# Altium schematic sheet Door.SchDoc
size A4
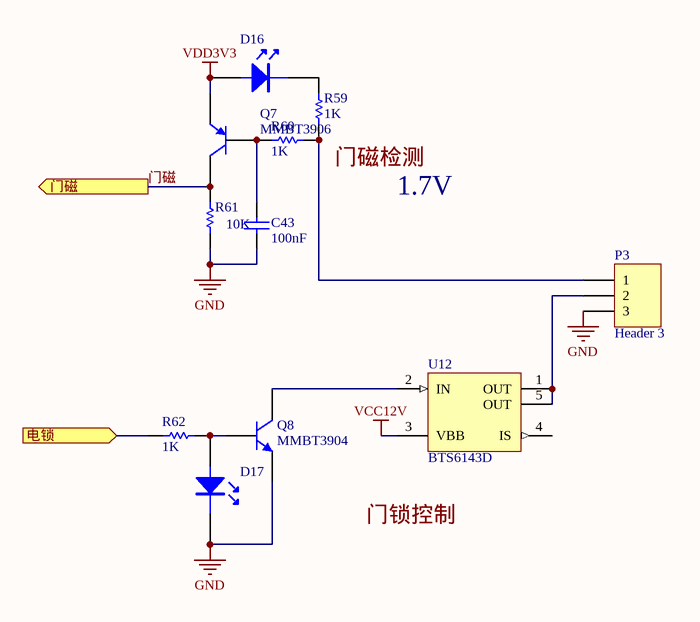
[diagram p0: Door.SchDoc]

## Parts
C43  value 100nF  [CAPC0805(2012)100_L]  (hidden comment: CAP 100nF 50V 0805(2012))
D16  (no value)  [0805-L]
D17  (no value)  [0805-L]
P3  Header 3  [HDR1X3]
Q7  MMBT3906  [SOT23_N]
Q8  MMBT3904  [SOT23_N]
R59  value 1K  [RESC0805(2012)_M]  (hidden comment: 1K 1% 0805(2012))
R60  value 1K  [RESC0805(2012)_M]  (hidden comment: 1K 1% 0805(2012))
R61  value 10K  [RESC0805(2012)_M]  (hidden comment: 10K 1% 0805(2012))
R62  value 1K  [RESC0805(2012)_M]  (hidden comment: 1K 1% 0805(2012))
U12  BTS6143D  [INF-PG-TO252-5-11_M]

## Ports
电锁 (in), 门磁 (out)

## Nets
GND: C43.1 D17.2 P3.3 Q8.2(E) R61.1
VCC12V: U12.3(VBB)
VDD3V3: D16.1 Q7.2(E)
电锁: R62.2 ; port 电锁
门磁: Q7.3(C) R61.2 ; port 门磁
NetC43_2: C43.2 Q7.1(B) R60.1
NetD16_2: D16.2 R59.2
NetD17_1: D17.1 Q8.1(B) R62.1
NetP3_1: P3.1 R59.1 R60.2
NetP3_2: P3.2 U12.1(OUT) U12.5(OUT)
NetQ8_3: Q8.3(C) U12.2(IN)

Not connected (* = marked no-connect by the designer): U12 4(IS)

## Notes on the sheet
- 门磁检测
- 1.7V
- 门锁控制

## Library data of the parts
C43 = CMP-1036-04418-1: CAP 100nF 50V ±5% 0805 (2012 Metric) Thickness 1mm SMD; Case-EIA: 0805; Case-Metric: 2012; Tolerance: ±5%; Max Thickness: 1 mm; Technology: SMT; Rated Voltage: 50 V
D16 D17 = LED
P3 = Header 3: Header, 3-Pin; LatestRevisionDate: 17-Jul-2002; LatestRevisionNote: Re-released for DXP Platform.; Publisher: Altium Limited
Q7 = MMBT3906: PNP Switching Transistor; Published: 17-Sep-2003; LatestRevisionDate: 12-Dec-2006; LatestRevisionNote: IPC-7351 Footprint Added.; DatasheetVersion: 11-Apr-2000; PackageVersion: May-1999; PackageReference: SOT23; Publisher: Altium Limited; PackageDescription: 3-Pin SOT-23 Package 0.95 mm Pitch, 2.3 mm Lead Span; ComponentLink1Description: Manufacturer Link; ComponentLink1URL: http://www.semiconductors.philips.com/; ComponentLink2Description: Datasheet; ComponentLink2URL: http://www.semiconductors.philips.com/acrobat/datasheets/MMBT3906_2.pdf
Q8 = MMBT3904: NPN Switching Transistor; Published: 17-Sep-2003; LatestRevisionDate: 12-Dec-2006; LatestRevisionNote: IPC-7351 Footprint Added.; DatasheetVersion: 13-May-2002; PackageVersion: May-1999; PackageReference: SOT23; Publisher: Altium Limited; PackageDescription: 3-Pin SOT-23 Package 0.95 mm Pitch, 2.3 mm Lead Span; ComponentLink1Description: Manufacturer Link; ComponentLink1URL: http://www.semiconductors.philips.com/; ComponentLink2Description: Datasheet; ComponentLink2URL: http://www.semiconductors.philips.com/acrobat/datasheets/MMBT3904_4.pdf
R59 R60 R62 = CMP-1013-00510-1: 1K 0.125W 1% 0805 (2012 Metric)  SMD; Case-Metric: 2012; Case-EIA: 0805; Tolerance: 1 %; Power: 0.125 W; Technology: SMT
R61 = CMP-1013-00623-1: 10K 0.125W 1% 0805 (2012 Metric)  SMD; Case-Metric: 2012; Case-EIA: 0805; Tolerance: 1 %; Power: 0.125 W; Technology: SMT
U12 = CMP-1095-00112-1: PROFET Smart Highside Power Switch, 1 Channel, 10 A Load Current, -40 to 150 degC, PG-TO252-5-11, Reel, Green; Manufacturer: Infineon; Recommended Operating Voltage Min.: 5.5 V; RON(max) @ 150degreesC: 18 mOhm; toff (max): 500 us; Load Current (typ): 10 A; RON @ 25degreesC: 10 mOhm; Recommended Operating Voltage Max.: 38 V; Green: TRUE; Ptot (max): 59 W; Group: Automotive Qualified; Channels: 1; Packing: Reel; ComponentLink1URL: http://www.infineon.com/; PartNumber: BTS6143D; Mounting Technology: Surface Mount; ComponentLink2Description: Datasheet; ComponentLink3URL: http://www.infineon.com/dgdl/TLE7276-Data+Sheet-+v1_11.pdf?folderId=db3a304412b407950112b408e8c90004&fileId=db3a304412b407950112b436c53f66c8&sId=db3a30433db6f09f013dc0e43c0428c1; ComponentLink3Description: Package Specification; ComponentLink2URL: http://www.infineon.com/dgdl/BTS6143D_DS_v10.pdf?folderId=db3a304314dca389011537739e37155f&fileId=db3a3043183a95550118606a2705368e&location=en.Products.Automotive_ICs.Smart_High-_and_Low-Side_Switches.PROFET__-_Smart_High_Side_Switches.DATASHEET.BTS6143D_D; ComponentLink1Description: Manufacturer URL; PackageVersion: Nov-10; PackageDescription: 5-Pin Plastic (Green) Transistor Single Outline Package, 6.5 x 6.12 mm Body, 1.14 mm Pitch; Halogen-free: TRUE; DatasheetVersion: Rev. 1.0; PackageReference: PG-TO252-5-11; ton (max): 500 us